# EAGLE schematic MS20-VCF (EAGLE 7.2.0)
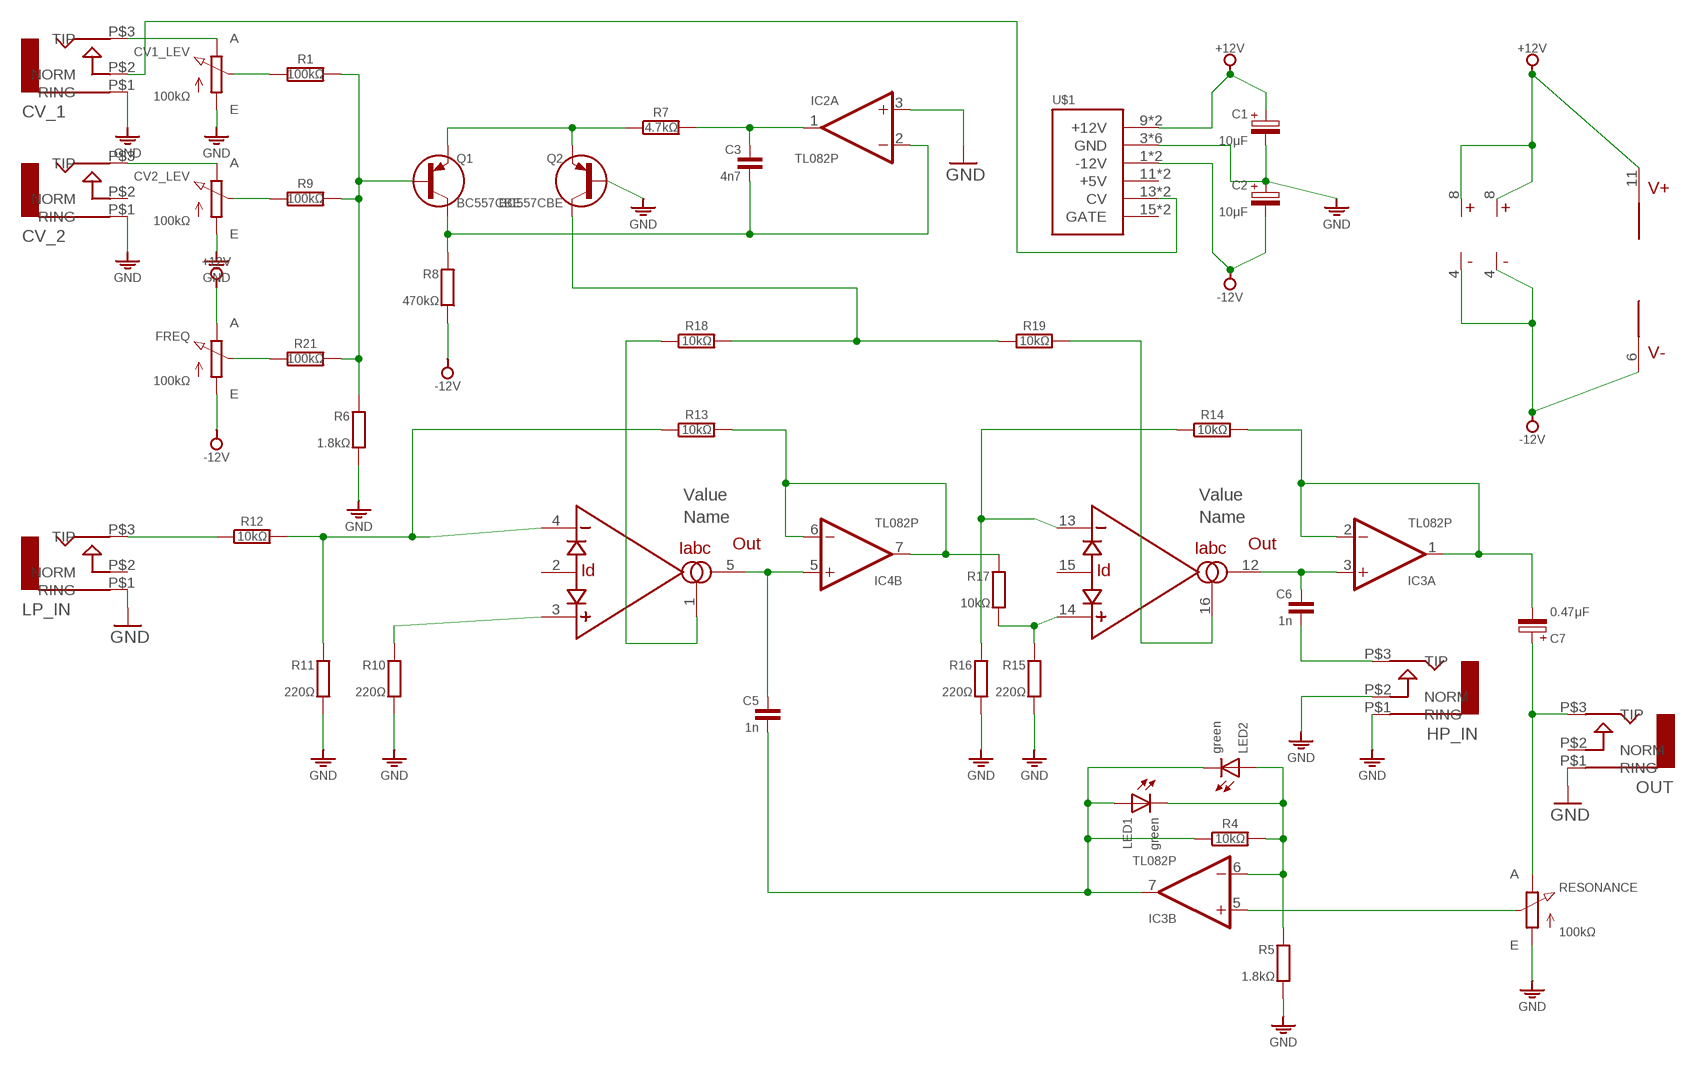
[diagram p0: schematic, sheet 1]

## Parts
C1  10μF  CPOLE2,5-5/V  [E2,5-5/V]
C2  10μF  CPOLE2,5-5/V  [E2,5-5/V]
C3  4n7  C050-020X036/V  [C050-020X036/V]
C5  1n  C050-020X036/V  [C050-020X036/V]
C6  1n  C050-020X036/V  [C050-020X036/V]
C7  0.47μF  CPOLE2,5-5/V  [E2,5-5/V]
CV1_LEV  100kΩ  POT-V  [POT-V]
CV2_LEV  100kΩ  POT-V  [POT-V]
CV_1  AUDIO-JACK  [ERTHENVAR-JACK-90DEG]
CV_2  AUDIO-JACK  [ERTHENVAR-JACK-90DEG]
FREQ  100kΩ  POT  [POT]
HP_IN  AUDIO-JACK  [ERTHENVAR-JACK-90DEG]
IC1  LM13700  [DIL16]
IC2  TL082P  [DIL08]
IC3  TL082P  [DIL08]
IC4  TL082P  [DIL08]
LED1  green  LED-3MM  [LED_3MM]
LED2  green  LED-3MM  [LED_3MM]
LP_IN  AUDIO-JACK  [ERTHENVAR-JACK-90DEG]
OUT  AUDIO-JACK  [ERTHENVAR-JACK-90DEG]
Q1  BC557CBE  [TO92-CBE]
Q2  BC557CBE  [TO92-CBE]
R1  100kΩ  R-H0204/10  [0204/10]
R4  10kΩ  R-H0204/10  [0204/10]
R5  1.8kΩ  R0204/10-V  [0204/10-V]
R6  1.8kΩ  R0204/10-V  [0204/10-V]
R7  4.7kΩ  R-H0204/10  [0204/10]
R8  470kΩ  R0204/10-V  [0204/10-V]
R9  100kΩ  R-H0204/10  [0204/10]
R10  220Ω  R0204/10-V  [0204/10-V]
R11  220Ω  R0204/10-V  [0204/10-V]
R12  10kΩ  R-H0204/10  [0204/10]
R13  10kΩ  R-H0204/10-V  [0204/10-V]
R14  10kΩ  R-H0204/10-V  [0204/10-V]
R15  220Ω  R0204/10-V  [0204/10-V]
R16  220Ω  R0204/10-V  [0204/10-V]
R17  10kΩ  R0204/10-V  [0204/10-V]
R18  10kΩ  R-H0204/10  [0204/10]
R19  10kΩ  R-H0204/10-V  [0204/10-V]
R21  100kΩ  R-H0204/10  [0204/10]
RESONANCE  100kΩ  POT  [POT]
U$1  POWER  [POWER_16]

## Nets
+12V: C1.+ FREQ.E IC1.11(V+) IC2.8(P:V+) IC3.8(P:V+) U$1.9(+12V) U$1.10(+12V)
-12V: C2.- FREQ.A IC1.6(V-) IC2.4(P:V-) IC3.4(P:V-) R8.2 U$1.1(-12V) U$1.2(-12V)
GND: C1.- C2.+ CV1_LEV.A CV2_LEV.A CV_1.P$1(RING) CV_2.P$1(RING) HP_IN.P$1(RING) HP_IN.P$2(NORM) IC2.3(A:+IN) LP_IN.P$1(RING) OUT.P$1(RING) Q2.B R5.2 R6.2 R10.2 R11.2 R15.2 R16.2 RESONANCE.A U$1.3(GND) U$1.4(GND) U$1.5(GND) U$1.6(GND) U$1.7(GND) U$1.8(GND)
N$1: IC3.6(B:-IN) LED1.K(C) LED2.A R4.2 R5.1
N$2: C5.2 IC3.7(B:OUT) LED1.A LED2.K(C) R4.1
N$3: C3.2 IC2.2(A:-IN) Q1.C R8.1
N$4: C3.1 IC2.1(A:OUT) R7.2
N$5: Q1.E Q2.E R7.1
N$6: IC3.5(B:+IN) RESONANCE.S
N$7: CV1_LEV.S R1.1
N$8: CV2_LEV.S R9.1
N$9: C5.1 IC1.5(OUT) IC4.5(B:+IN)
N$10: C6.1 IC1.12(OUT) IC3.3(A:+IN)
N$11: C7.- IC3.1(A:OUT) IC3.2(A:-IN) R14.2
N$12: C7.+ OUT.P$3(TIP) RESONANCE.E
N$13: IC1.1(IABC) R18.1
N$14: IC1.4(-IN) R11.1 R12.2 R13.1
N$15: IC1.3(+IN) R10.1
N$16: Q2.C R18.2 R19.1
N$17: IC1.16(IABC) R19.2
N$18: IC1.13(-IN) R14.1 R16.1
N$19: IC4.6(B:-IN) IC4.7(B:OUT) R13.2 R17.1
N$20: IC1.14(+IN) R15.1 R17.2
N$21: Q1.B R1.2 R6.1 R9.2 R21.2
N$22: FREQ.S R21.1
N$23: CV2_LEV.E CV_2.P$3(TIP)
N$24: CV1_LEV.E CV_1.P$3(TIP)
N$25: LP_IN.P$3(TIP) R12.1
N$26: C6.2 HP_IN.P$3(TIP)
N$27: CV_1.P$2(NORM) U$1.13(CV) U$1.14(CV)
Unconnected: CV_2.P$2(NORM) IC1.2(ID) IC1.7(IN) IC1.8(OUT) IC1.9(OUT) IC1.10(IN) IC1.15(ID) IC2.5(B:+IN) IC2.6(B:-IN) IC2.7(B:OUT) IC4.1(A:OUT) IC4.2(A:-IN) IC4.3(A:+IN) LP_IN.P$2(NORM) OUT.P$2(NORM) U$1.11(+5V) U$1.12(+5V) U$1.15(GATE) U$1.16(GATE)

## Power pins joined to a net without a drawn wire
V+: IC4.8(P:V+)
V-: IC4.4(P:V-)

## Library data of the parts
C1 C2 C7 = c:CPOL: POLARIZED CAPACITOR, European symbol
C3 C5 C6 = c:C: CAPACITOR, European symbol
CV1_LEV CV2_LEV FREQ RESONANCE = r:POT
CV_1 CV_2 HP_IN LP_IN OUT = erthenvar:AUDIO-JACK: Switching Mono 3.5mm Audio Jack from Erthenvar.
IC1 = ic:LM13700
IC2-IC4 = ic:TL082: JFET-Input Operational Amplifiers http://www.ti.com/lit/ds/symlink/tl082.pdf; DATA_SHEET: <a href="http://www.ti.com/lit/ds/symlink/tl084a.pdf"> Data sheet </a>
LED1 LED2 = d:LED
Q1 Q2 = t:BC557
R1 R4 R7 R9 R12-R14 R18 R19 R21 = r:R-H
R5 R6 R8 R10 R11 R15-R17 = r:R: RESISTOR, European symbol
U$1 = eurorack:POWER